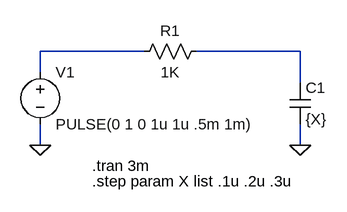
[diagram p0: schematic StepParam.asc]
StepParam.asc, the LTspice schematic file:
Version 4
SHEET 1 892 692
WIRE 336 336 336 304
WIRE 336 448 336 416
WIRE 496 304 336 304
WIRE 736 304 576 304
WIRE 736 352 736 304
WIRE 736 448 736 416
FLAG 736 448 0
FLAG 336 448 0
SYMBOL cap 720 352 R0
SYMATTR InstName C1
SYMATTR Value {X}
SYMBOL res 592 288 R90
WINDOW 0 0 56 VBottom 0
WINDOW 3 32 56 VTop 0
SYMATTR InstName R1
SYMATTR Value 1K
SYMBOL voltage 336 320 R0
SYMATTR InstName V1
SYMATTR Value PULSE(0 1 0 1u 1u .5m 1m)
TEXT 416 480 Left 0 !.tran 3m
TEXT 416 504 Left 0 !.step param X list .1u .2u .3u

The netlist it stands for:
* StepParam.asc
C1 N002 0 {X}
R1 N002 N001 1K
V1 N001 0 PULSE(0 1 0 1u 1u .5m 1m)
.tran 3m
.step param X list .1u .2u .3u
.backanno
.end